# Altium schematic sheet DriveInterface.SchDoc: Drive Interface
size Letter; Engineer: Nathan Petersen; DocumentNumber: 12; Revision: v1.2; SheetNumber: 12; SheetTotal: 23
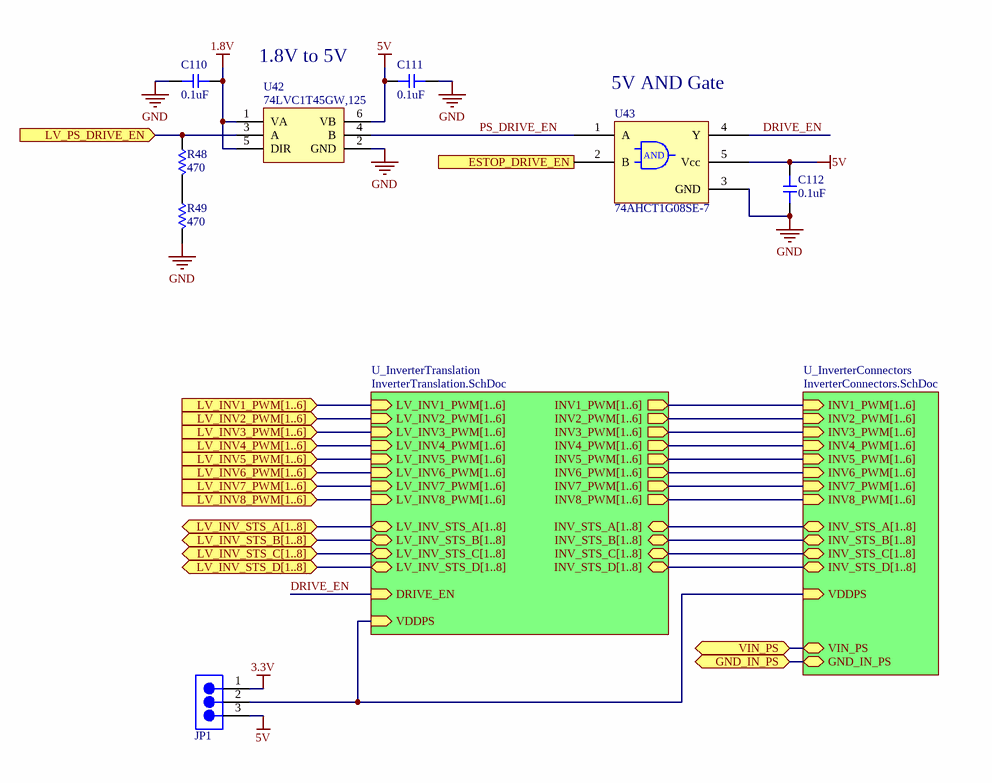
[diagram p0: DriveInterface.SchDoc]

## Parts
C110  value 0.1uF  [0603-CAP]  (hidden comment: Capacitor)
C111  value 0.1uF  [0603-CAP]  (hidden comment: Capacitor)
C112  value 0.1uF  [0603-CAP]  (hidden comment: Capacitor)
JP1  Jumper3  [PIN_HEADER_1X3]  (value not drawn)
R48  value 470  [0603-RES]  (hidden comment: Resistor)
R49  value 470  [0603-RES]  (hidden comment: Resistor)
U42  74LVC1T45GW,125  [SOT65P210X110-6N]
U43  74AHCT1G08SE-7  [SOT65P210X110-5N]

## Sub-sheets
U_InverterConnectors = InverterConnectors.SchDoc: INV1_PWM[1..6] (in), INV3_PWM[1..6] (in), INV4_PWM[1..6] (in), INV5_PWM[1..6] (in), INV6_PWM[1..6] (in), INV7_PWM[1..6] (in), INV8_PWM[1..6] (in), INV2_PWM[1..6] (in), INV_STS_A[1..8] (bidir), INV_STS_C[1..8] (bidir), INV_STS_B[1..8] (bidir), INV_STS_D[1..8] (bidir), VDDPS (in), GND_IN_PS (bidir), VIN_PS (bidir)
U_InverterTranslation = InverterTranslation.SchDoc: LV_INV2_PWM[1..6] (in), LV_INV3_PWM[1..6] (in), LV_INV4_PWM[1..6] (in), LV_INV5_PWM[1..6] (in), LV_INV6_PWM[1..6] (in), LV_INV7_PWM[1..6] (in), LV_INV8_PWM[1..6] (in), LV_INV1_PWM[1..6] (in), DRIVE_EN (in), LV_INV_STS_A[1..8] (bidir), LV_INV_STS_D[1..8] (bidir), LV_INV_STS_C[1..8] (bidir), LV_INV_STS_B[1..8] (bidir), INV2_PWM[1..6] (out), INV3_PWM[1..6] (out), INV4_PWM[1..6] (out), INV5_PWM[1..6] (out), INV6_PWM[1..6] (out), INV7_PWM[1..6] (out), INV8_PWM[1..6] (out), INV1_PWM[1..6] (out), INV_STS_A[1..8] (bidir), INV_STS_B[1..8] (bidir), INV_STS_D[1..8] (bidir), INV_STS_C[1..8] (bidir), VDDPS (in)

## Ports
ESTOP_DRIVE_EN (in), GND_IN_PS (bidir), LV_INV1_PWM[1..6] (in), LV_INV2_PWM[1..6] (in), LV_INV3_PWM[1..6] (in), LV_INV4_PWM[1..6] (in), LV_INV5_PWM[1..6] (in), LV_INV6_PWM[1..6] (in), LV_INV7_PWM[1..6] (in), LV_INV8_PWM[1..6] (in), LV_INV_STS_A[1..8] (bidir), LV_INV_STS_B[1..8] (bidir), LV_INV_STS_C[1..8] (bidir), LV_INV_STS_D[1..8] (bidir), LV_PS_DRIVE_EN (in), VIN_PS (bidir)

## Nets
1.8V: C110.2 U42.1(VA) U42.5(DIR)
3.3V: JP1.1
5V: C111.1 C112.2 JP1.3 U42.6(VB) U43.5(Vcc)
GND: C110.1 C111.2 C112.1 R49.2 U42.2(GND) U43.3(GND)
DRIVE_EN: U43.4(Y) ; sheet U_InverterTranslation/DRIVE_EN
ESTOP_DRIVE_EN: U43.2(B) ; port ESTOP_DRIVE_EN
GND_IN_PS: port GND_IN_PS, sheet U_InverterConnectors/GND_IN_PS
LV_PS_DRIVE_EN: R48.1 U42.3(A) ; port LV_PS_DRIVE_EN
PS_DRIVE_EN: U42.4(B) U43.1(A)
VIN_PS: port VIN_PS, sheet U_InverterConnectors/VIN_PS
NetJP1_2: JP1.2 ; sheet U_InverterConnectors/VDDPS, sheet U_InverterTranslation/VDDPS
NetR48_2: R48.2 R49.1

## Buses and harness runs
bus port LV_INV1_PWM[1..6] = sheet U_InverterTranslation/LV_INV1_PWM[1..6]
bus port LV_INV2_PWM[1..6] = sheet U_InverterTranslation/LV_INV2_PWM[1..6]
bus port LV_INV3_PWM[1..6] = sheet U_InverterTranslation/LV_INV3_PWM[1..6]
bus port LV_INV4_PWM[1..6] = sheet U_InverterTranslation/LV_INV4_PWM[1..6]
bus port LV_INV5_PWM[1..6] = sheet U_InverterTranslation/LV_INV5_PWM[1..6]
bus port LV_INV6_PWM[1..6] = sheet U_InverterTranslation/LV_INV6_PWM[1..6]
bus port LV_INV7_PWM[1..6] = sheet U_InverterTranslation/LV_INV7_PWM[1..6]
bus port LV_INV8_PWM[1..6] = sheet U_InverterTranslation/LV_INV8_PWM[1..6]
bus port LV_INV_STS_A[1..8] = sheet U_InverterTranslation/LV_INV_STS_A[1..8]
bus port LV_INV_STS_B[1..8] = sheet U_InverterTranslation/LV_INV_STS_B[1..8]
bus port LV_INV_STS_C[1..8] = sheet U_InverterTranslation/LV_INV_STS_C[1..8]
bus port LV_INV_STS_D[1..8] = sheet U_InverterTranslation/LV_INV_STS_D[1..8]
bus sheet U_InverterConnectors/INV1_PWM[1..6] = sheet U_InverterTranslation/INV1_PWM[1..6]
bus sheet U_InverterConnectors/INV2_PWM[1..6] = sheet U_InverterTranslation/INV2_PWM[1..6]
bus sheet U_InverterConnectors/INV3_PWM[1..6] = sheet U_InverterTranslation/INV3_PWM[1..6]
bus sheet U_InverterConnectors/INV4_PWM[1..6] = sheet U_InverterTranslation/INV4_PWM[1..6]
bus sheet U_InverterConnectors/INV5_PWM[1..6] = sheet U_InverterTranslation/INV5_PWM[1..6]
bus sheet U_InverterConnectors/INV6_PWM[1..6] = sheet U_InverterTranslation/INV6_PWM[1..6]
bus sheet U_InverterConnectors/INV7_PWM[1..6] = sheet U_InverterTranslation/INV7_PWM[1..6]
bus sheet U_InverterConnectors/INV8_PWM[1..6] = sheet U_InverterTranslation/INV8_PWM[1..6]
bus sheet U_InverterConnectors/INV_STS_A[1..8] = sheet U_InverterTranslation/INV_STS_A[1..8]
bus sheet U_InverterConnectors/INV_STS_B[1..8] = sheet U_InverterTranslation/INV_STS_B[1..8]
bus sheet U_InverterConnectors/INV_STS_C[1..8] = sheet U_InverterTranslation/INV_STS_C[1..8]
bus sheet U_InverterConnectors/INV_STS_D[1..8] = sheet U_InverterTranslation/INV_STS_D[1..8]

## Notes on the sheet
- 1.8V to 5V
- (near U43) 5V AND Gate
- Title:
- File:
- Sheet:
- of
- Revision:
- Time:
- Date:
- Engineer:
- (in symbol 74AHCT1G08SE-7) AND

## Library data of the parts
U42 = 74LVC1T45GW,125: TXRX XLATING DUAL 3ST 6TSSOP; Supplier 1: Digi-Key; Supplier Part Number 1: 1727-4560-1-ND
U43 = 74AHCT1G08SE-7: IC GATE AND 1CH 2-INP SOT353; Supplier 1: Digi-Key; Supplier Part Number 1: 74AHCT1G08SE-7DICT-ND
C110-C112 = Capacitor: Supplier 1: Digi-Key; Supplier Part Number 1: 1276-1012-6-ND
JP1 = Jumper3: Supplier 1: Digi-Key; Supplier Part Number 1: 732-5316-ND
R48 R49 = Resistor: Supplier 1: Digi-Key; Supplier Part Number 1: 311-470LDCT-ND